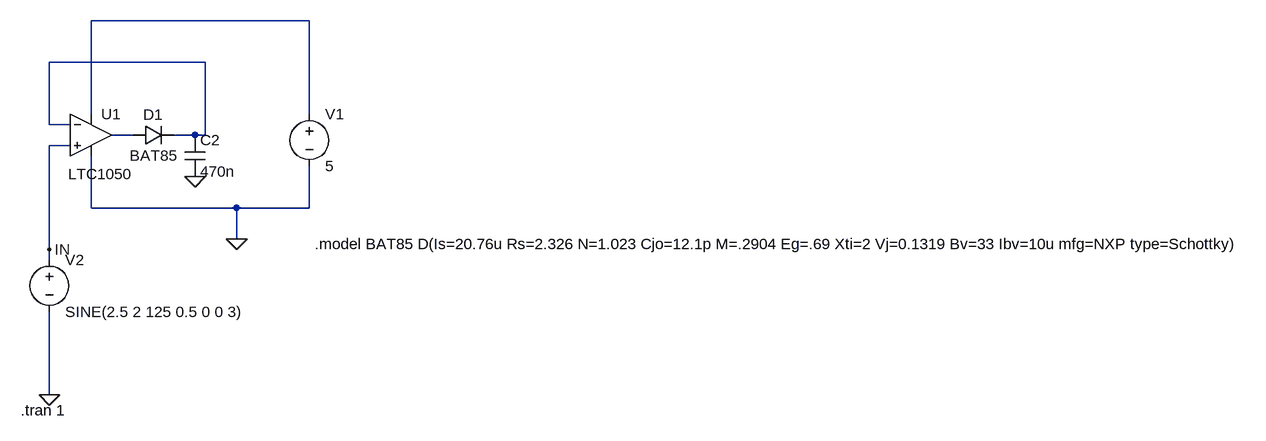
[diagram p0: schematic phototransistor-simple.asc]
phototransistor-simple.asc, the LTspice schematic file:
Version 4
SHEET 1 1036 1712
WIRE -1680 384 -2016 384
WIRE -1840 448 -2080 448
WIRE -2016 528 -2016 384
WIRE -1680 528 -1680 384
WIRE -2080 544 -2080 448
WIRE -2048 544 -2080 544
WIRE -1952 560 -1984 560
WIRE -1856 560 -1888 560
WIRE -1840 560 -1840 448
WIRE -1840 560 -1856 560
WIRE -2048 576 -2080 576
WIRE -2016 672 -2016 592
WIRE -1792 672 -2016 672
WIRE -1680 672 -1680 608
WIRE -1680 672 -1792 672
WIRE -1792 720 -1792 672
WIRE -2080 736 -2080 576
WIRE -2080 752 -2080 736
WIRE -2080 960 -2080 832
FLAG -2080 736 IN
FLAG -1856 624 0
FLAG -2080 960 0
FLAG -1792 720 0
SYMBOL voltage -2080 736 R0
WINDOW 123 0 0 Left 2
WINDOW 39 0 0 Left 2
SYMATTR InstName V2
SYMATTR Value SINE(2.5 2 125 0.5 0 0 3)
SYMBOL cap -1872 560 R0
SYMATTR InstName C2
SYMATTR Value 470n
SYMBOL voltage -1680 512 R0
WINDOW 123 0 0 Left 2
WINDOW 39 0 0 Left 2
SYMATTR InstName V1
SYMATTR Value 5
SYMBOL diode -1952 576 R270
WINDOW 0 32 32 VTop 2
WINDOW 3 0 32 VBottom 2
SYMATTR InstName D1
SYMATTR Value BAT85
SYMBOL Opamps\\LTC1050 -2016 496 R0
WINDOW 3 -35 124 Left 2
SYMATTR InstName U1
TEXT -2124 984 Left 2 !.tran 1
TEXT -1672 728 Left 2 !.model BAT85 D(Is=20.76u Rs=2.326 N=1.023 Cjo=12.1p M=.2904 Eg=.69 Xti=2 Vj=0.1319 Bv=33 Ibv=10u mfg=NXP type=Schottky)

The netlist it stands for:
* phototransistor-simple.asc
V2 IN 0 SINE(2.5 2 125 0.5 0 0 3)
C2 N002 0 470n
V1 N001 0 5
D1 N003 N002 BAT85
XU1 IN N002 N001 0 N003 LTC1050  ; pins In+ In- V+ V- OUT
.model D D
.lib standard.dio
.tran 1
.model BAT85 D(Is=20.76u Rs=2.326 N=1.023 Cjo=12.1p M=.2904 Eg=.69 Xti=2 Vj=0.1319 Bv=33 Ibv=10u mfg=NXP type=Schottky)
.lib LTC.lib
.backanno
.end